# EAGLE design interfaceBoard (EAGLE 9.6.1)
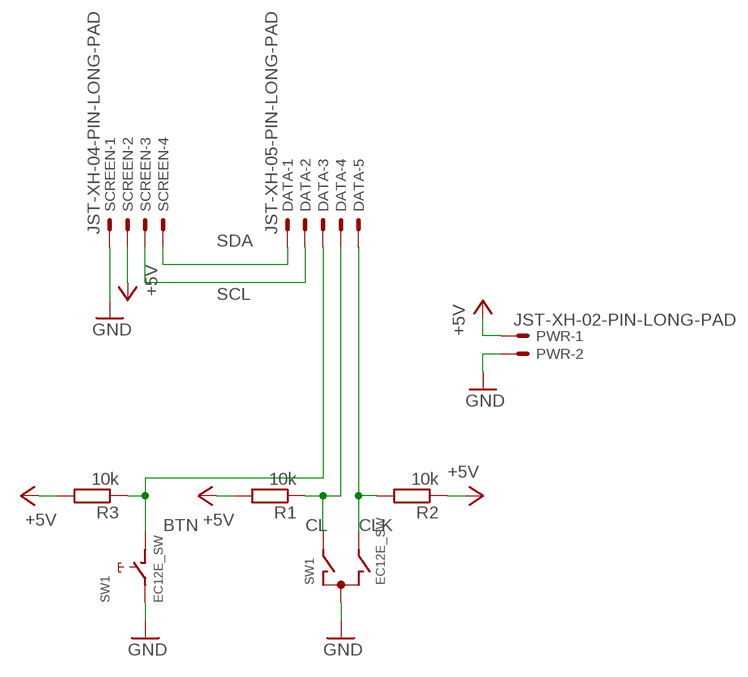
[diagram p0: schematic, sheet 1]

## Parts
DATA  JST-XH-05-PIN-LONG-PAD  [JST-XH-05-PACKAGE-LONG-PAD]
PWR  JST-XH-02-PIN-LONG-PAD  [JST-XH-02-PACKAGE-LONG-PAD]
R1  10k  R-EU_0204/7  [0204/7]
R2  10k  R-EU_0204/7  [0204/7]
R3  10k  R-EU_0204/7  [0204/7]
SCREEN  JST-XH-04-PIN-LONG-PAD  [JST-XH-04-PACKAGE-LONG-PAD]
SW1  EC12E_SW  [ALPS_EC12E_SW]

## Nets
+5V: PWR.1 R1.2 R2.1 R3.2 SCREEN.2
BTN: DATA.3 R3.1 SW1.D
CL: DATA.4 R1.1 SW1.A
CLK: DATA.5 R2.2 SW1.B
GND: PWR.2 SCREEN.1 SW1.C SW1.E
SCL: DATA.2 SCREEN.3
SDA: DATA.1 SCREEN.4
Unconnected: SW1.GND1(G) SW1.GND2(G)

## Library data of the parts
DATA = Rembrandt Electronics - JST XH Connectors v1-0:JST-XH-05-PIN: JST XH Connector 2 Pin Wire to board connector. Pitch: 2,54 mm, (0.100") Number of pins: 5 Created by Rembrandt Electronics www.rembrandtelectronics.com
PWR = Rembrandt Electronics - JST XH Connectors v1-0:JST-XH-02-PIN: JST XH Connector 2 Pin Wire to board connector. Pitch: 2,54 mm, (0.100") Number of pins: 2 Created by Rembrandt Electronics www.rembrandtelectronics.com
R1-R3 = rcl:R-EU_: RESISTOR, European symbol; SPICEPREFIX: R
SCREEN = Rembrandt Electronics - JST XH Connectors v1-0:JST-XH-04-PIN: JST XH Connector 2 Pin Wire to board connector. Pitch: 2,54 mm, (0.100") Number of pins: 4 Created by Rembrandt Electronics www.rembrandtelectronics.com
SW1 = switch-alps:EC12E_SW: ALPS rotary Encoder EC12E series with switch; MPN: EC12E2424407; OC_FARNELL: 1520813; OC_NEWARK: 74M1068

## Board
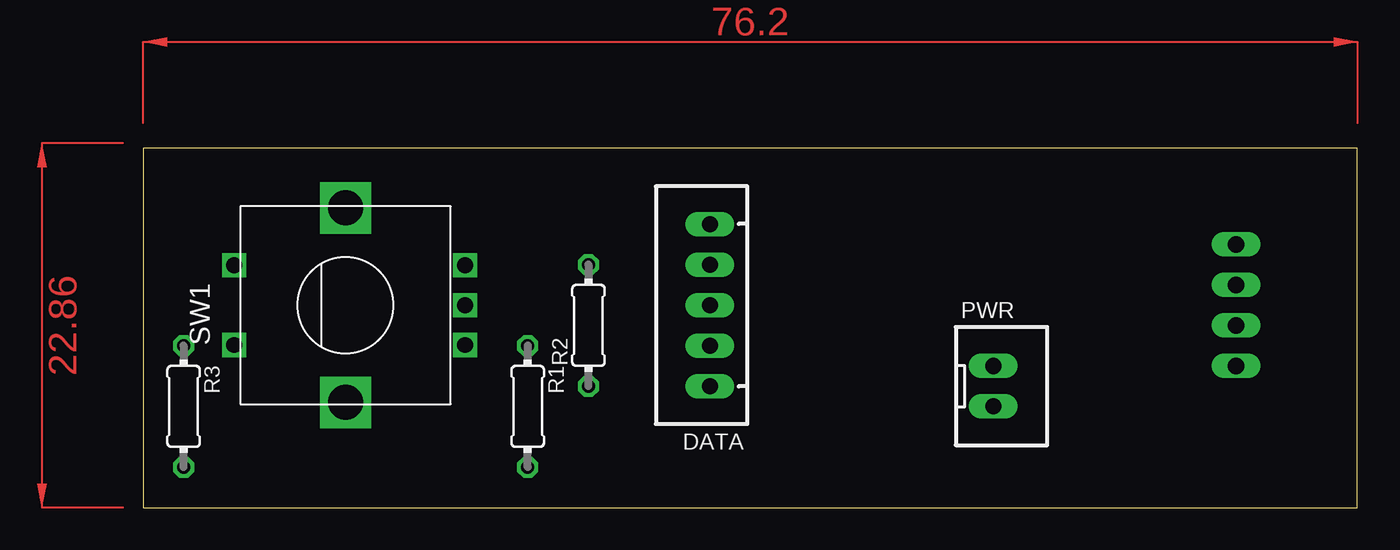
[diagram p1: board, top side]
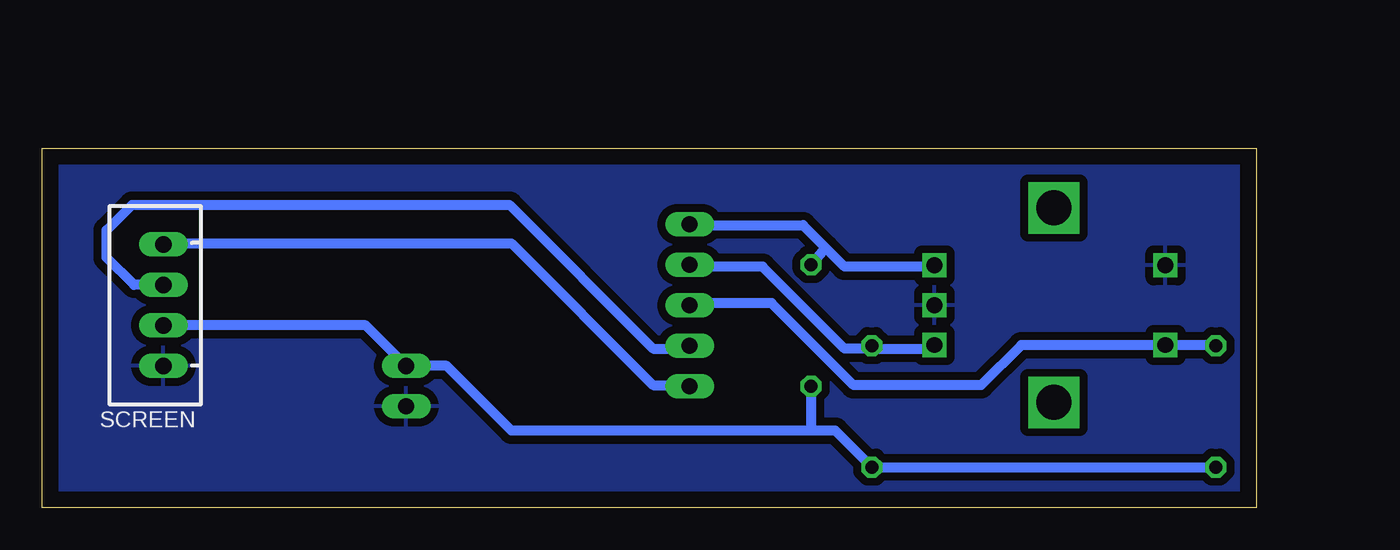
[diagram p2: board, bottom side, seen from below]

Size 76.18 x 22.53 mm. Coordinates in mm from the lower left corner, seen from the top.
Outline: 0,0 76.18,0 76.18,22.53 0,22.53 0,0
Copper layers (1*16): Top 0.035mm / dielectric 1.5mm / Bottom 0.035mm
Design rules "default2": minimum track width 25mil, minimum drill 0.35mm, track to track 20mil, track to pad 20mil, pad to pad 20mil, via to via 20mil, smd to smd 20mil, copper to edge 40mil, drill to drill 6mil, minimum pad ring 10mil, minimum via ring 8mil, stop-mask expansion 4mil, vias tented up to drill 0mil, thermal gap 20mil

### Footprints (pad centres in the part's own frame; a part is rotated, then mirrored left to right if it is on the bottom)
JST-XH-05-PACKAGE-LONG-PAD = drill 1.016 long: 1 -5.08,0; 2 -2.54,0; 3 0,0; 4 2.54,0; 5 5.08,0
JST-XH-02-PACKAGE-LONG-PAD = drill 1.016 long: 1 -1.27,0; 2 1.27,0
0204/7 = drill 0.813 octagon: 1 -3.81,0; 2 3.81,0
JST-XH-04-PACKAGE-LONG-PAD = drill 1.016 long: 1 -3.81,0; 2 -1.27,0; 3 1.27,0; 4 3.81,0
ALPS_EC12E_SW = drill 1 square: A -2.5,-7.5; B 2.5,-7.5; C 0,-7.5; D -2.5,7; E 2.5,7 | drill 2.2 square: GND1 -6.1,0; GND2 6.1,0

### Placement (x,y rotation side)
DATA  35.56,12.7 90 top
PWR  53.34,7.62 270 top
R1  24.13,6.35 270 top
R2  27.94,11.43 90 top
R3  2.54,6.35 270 top
SCREEN  68.58,12.7 90 bottom
SW1  12.7,12.7 90 top

### Tracks (layer width: path | path; a pad name or v marks a point on that pad's centre or on a via)
+5V
  Bottom 0.635: R3.2 R1.2 26.42,4.83 27.94,4.83 | R2.1 27.94,4.83 | 27.94,4.83 46.74,4.83 50.8,8.89 PWR.1 55.88,11.43 SCREEN.2
BTN
  Bottom 0.635: DATA.3 35.56,12.83 30.42,12.83 25.27,7.68 17.27,7.68 14.76,10.2 SW1.D 2.58,10.2 R3.1
CL
  Bottom 0.635: 24.13,9.97 20.7,9.97 SW1.A | 24.13,9.97 25.84,9.97 30.99,15.11 35.56,15.11 DATA.4 | 24.13,9.97 R1.1
CLK
  Bottom 0.635: 27.03,16.3 25.84,15.11 20.7,15.11 SW1.B | 27.03,16.3 R2.2 | DATA.5 35.5,17.72 28.45,17.72 27.03,16.3
GND
  pour Bottom: 0,22.86 76.2,22.86 76.2,0 0,0
SCL
  Bottom 0.635: SCREEN.3 70.42,13.97 72.14,15.68 72.14,17.4 70.55,18.99 46.86,18.99 37.85,9.97 35.56,9.97 DATA.2
SDA
  Bottom 0.635: DATA.1 35.56,7.68 37.85,7.68 46.74,16.57 68.61,16.57 SCREEN.4
(copper drawn outside any net)
  shapes: Top area x2